# Altium schematic sheet Buck_TPSM82913_3V7.SchDoc
size B; SheetNumber: 12; SheetTotal: 15
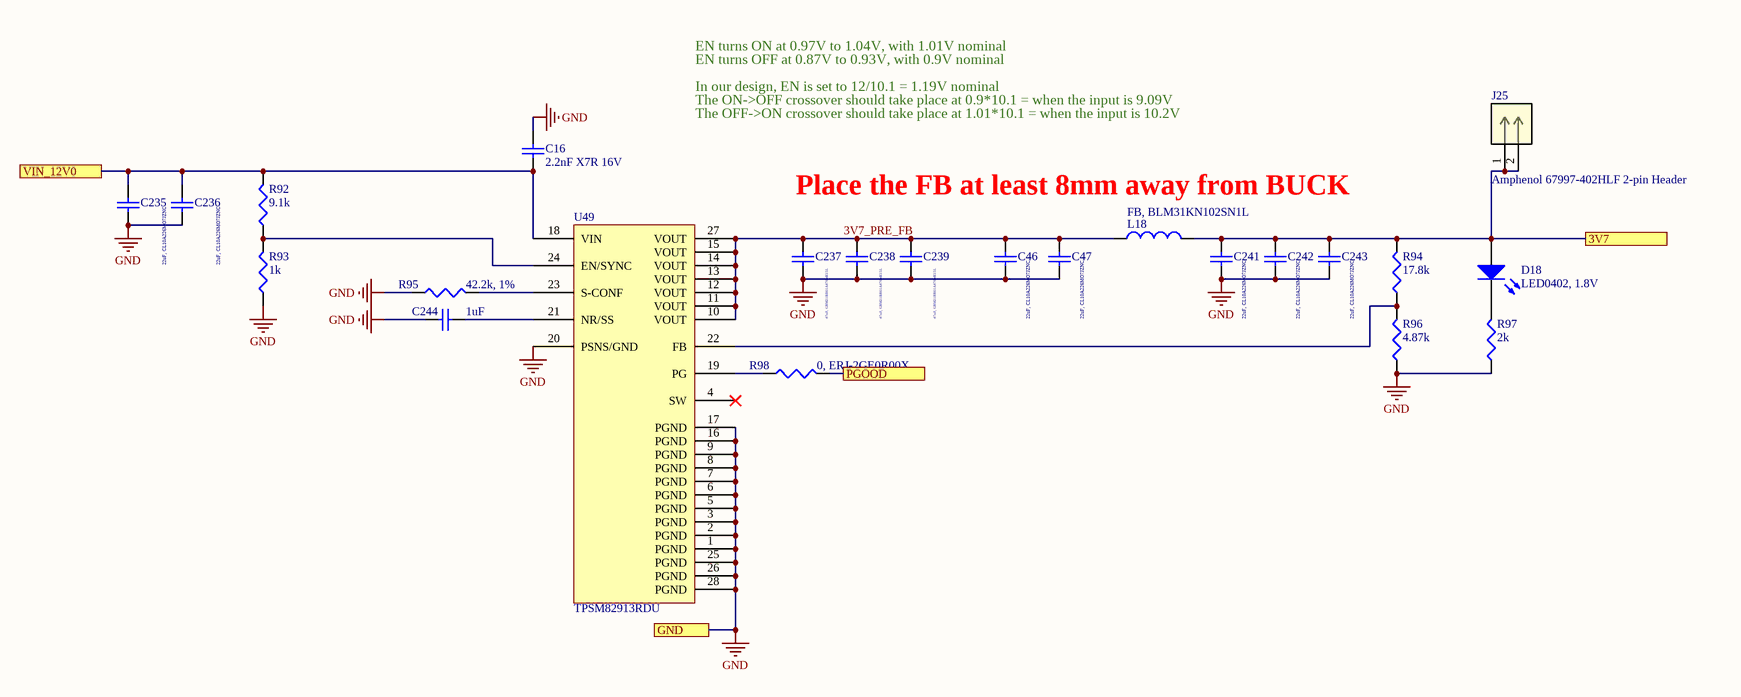
[diagram p0: Buck_TPSM82913_3V7.SchDoc]

## Parts
C16  2.2nF X7R 16V  [SMD-0402]
C46  22uF, CL10A226MO7JZNC  [SMD-0603]
C47  22uF, CL10A226MO7JZNC  [SMD-0603]
C235  22uF, CL10A226MO7JZNC  [SMD-0603]
C236  22uF, CL10A226MO7JZNC  [SMD-0603]
C237  47uF, GRM21BR61A476ME15L  [SMD-0805]
C238  47uF, GRM21BR61A476ME15L  [SMD-0805]
C239  47uF, GRM21BR61A476ME15L  [SMD-0805]
C241  22uF, CL10A226MO7JZNC  [SMD-0603]
C242  22uF, CL10A226MO7JZNC  [SMD-0603]
C243  22uF, CL10A226MO7JZNC  [SMD-0603]
C244  1uF  [SMD-0402]
D18  LED0402, 1.8V  [LED-0402]
J25  Amphenol 67997-402HLF 2-pin Header  [Amphenol  67997-402HLF 2-pin header]
L18  FB, BLM31KN102SN1L  [SMD-1206]
R92  9.1k  [SMD-0402]
R93  1k  [SMD-0402]
R94  17.8k  [SMD-0402]
R95  42.2k, 1%  [SMD-0402]
R96  4.87k  [SMD-0402]
R97  2k  [SMD-0402]
R98  0, ERJ-2GE0R00X  [SMD-0402]
U49  TPSM82913RDU  [TPSM82913DRUR]

## Ports
3V7 (see Main[2D], IQ_Mod[4D]), GND (see Main[2D], 3V7_to_3V3_LDO[1B], 5V5_to_5V0_LDO[1C], Buck_TPSM82913_1V8[3C], Buck_TPSM82913_5V0[3C], Buck_TPSM82913_5V5[2C], Clocking_and_LO[2A], Fan_Interfaces[2B], IQ_Demod[1C], IQ_Mod[1B], LMX2820[4D], Microzed_Interfaces[1A], Power_Supply[6B], Voltage_Conv_Bidirectional[1B]), PGOOD (see Main[1D]), VIN_12V0 (see Main[1D], Buck_TPSM82913_5V0[1B], Buck_TPSM82913_5V5[1B])

## Nets
GND: C16.2 C46.1 C47.1 C235.1 C236.1 C237.1 C238.1 C239.1 C241.1 C242.1 C243.1 C244.1 R93.1 R95.1 R96.1 R97.1 U49.1(PGND) U49.2(PGND) U49.3(PGND) U49.5(PGND) U49.6(PGND) U49.7(PGND) U49.8(PGND) U49.9(PGND) U49.16(PGND) U49.17(PGND) U49.20(PSNS/GND) U49.25(PGND) U49.26(PGND) U49.28(PGND) ; port GND
3V7: C241.2 C242.2 C243.2 D18.1(A) J25.1 J25.2 L18.2 R94.2 ; port 3V7
3V7_PRE_FB: C46.2 C47.2 C237.2 C238.2 C239.2 L18.1 U49.10(VOUT) U49.11(VOUT) U49.12(VOUT) U49.13(VOUT) U49.14(VOUT) U49.15(VOUT) U49.27(VOUT)
PGOOD: R98.2 ; port PGOOD
VIN_12V0: C16.1 C235.2 C236.2 R92.2 U49.18(VIN) ; port VIN_12V0
NetC244_2: C244.2 U49.21(NR/SS)
NetD18_2: D18.2(K) R97.2
NetR92_1: R92.1 R93.2 U49.24(EN/SYNC)
NetR94_1: R94.1 R96.2 U49.22(FB)
NetR95_2: R95.2 U49.23(S-CONF)
NetR98_1: R98.1 U49.19(PG)

Not connected (* = marked no-connect by the designer): U49 4(SW)*

## Notes on the sheet
- EN turns OFF at 0.87V to 0.93V, with 0.9V nominal
- EN turns ON at 0.97V to 1.04V, with 1.01V nominal
- In our design, EN is set to 12/10.1 = 1.19V nominal
- The ON->OFF crossover should take place at 0.9*10.1 = when the input is 9.09V
- The OFF->ON crossover should take place at 1.01*10.1 = when the input is 10.2V
- Place the FB at least 8mm away from BUCK

## Library data of the parts
C16 C244 = CAP0402: Ceramic Capacitor 0402
C46 C47 C235 C236 C241-C243 = CAP0603: Ceramic Capacitor 0603
C237-C239 = CAP0805: Ceramic Capacitor 0805 Imperial (2012 Metric)
D18 = LED0402: LED 0402
J25 = Amphenol 67997-402HLF 2-pin Header: No Description Available; Mfr_Name: Amphenol ICC; RefDes: RefDes; Type: Type
L18 = L1206: Inductor 1206
R92-R98 = RES0402: Resistor-0402